# Altium project HIVE_SIGHT.PrjPcb (part 3 of 4)

## Sheet HIVE_SIGHT_DECAWAVE_B.SchDoc
size Tabloid; SheetNumber: 4; SheetTotal: 6; Sheet_Name: DECAWAVE; Size: 11x17
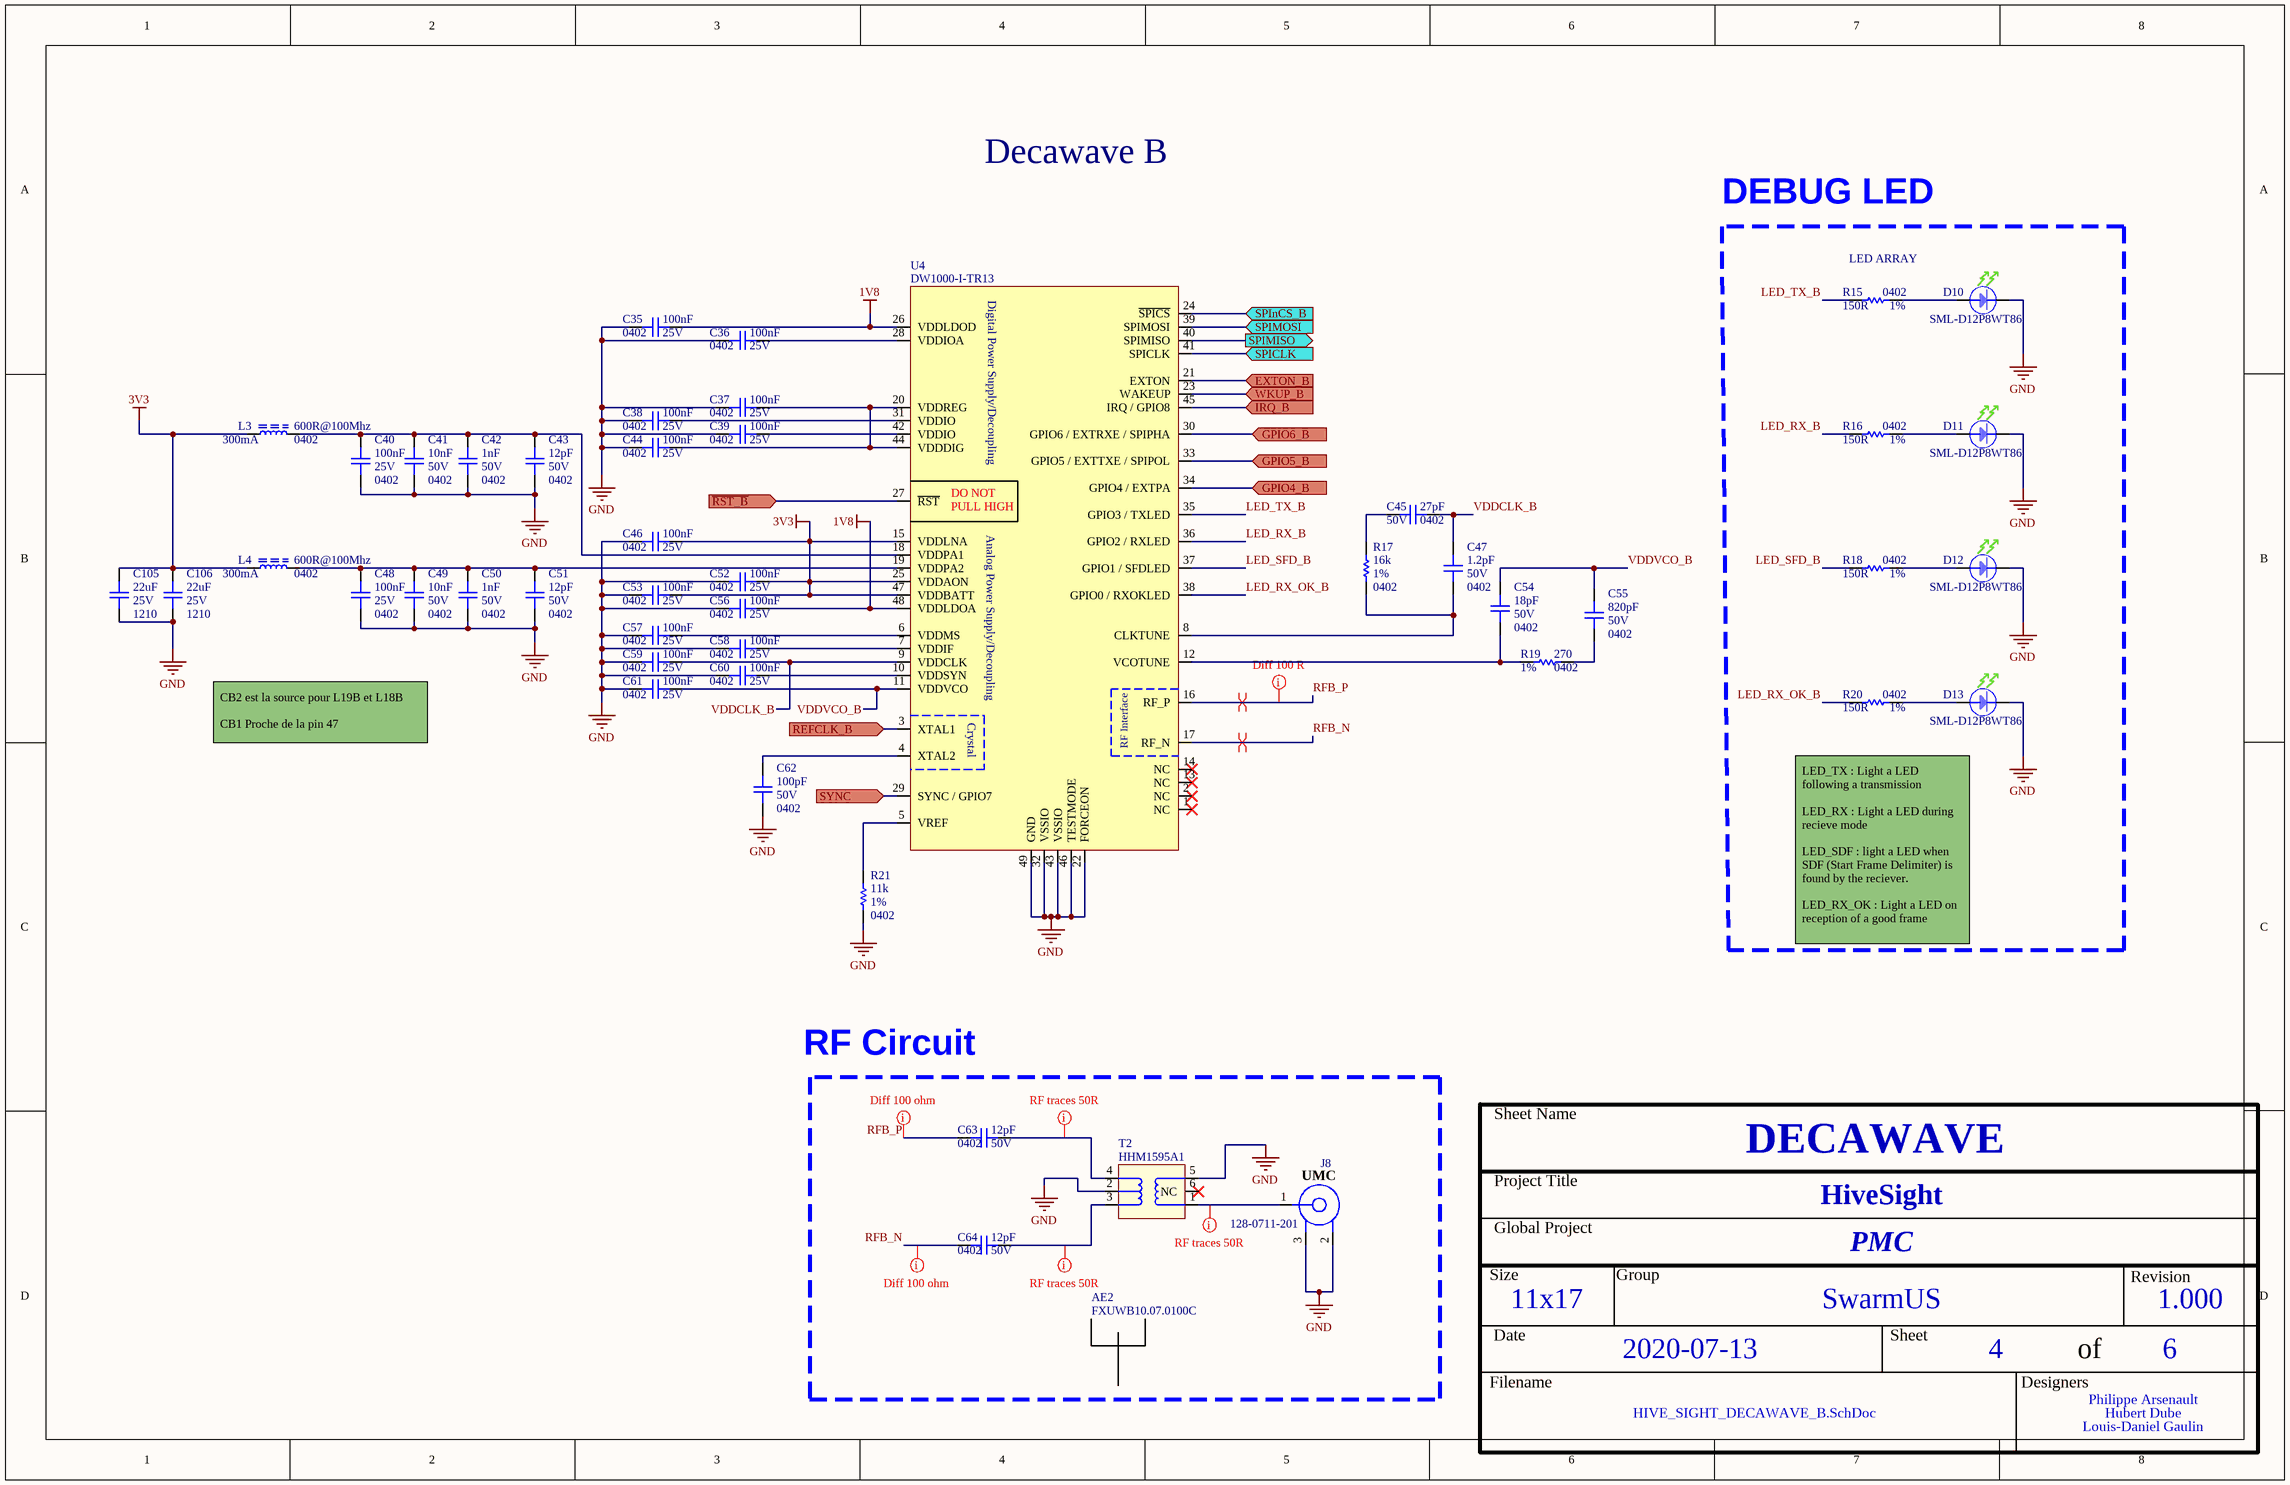
[diagram p6: HIVE_SIGHT_DECAWAVE_B.SchDoc]

### Parts
AE2  FXUWB10.07.0100C  (mechanical)
C35  value 100nF  Package: 0402  Voltage Rating: 25V  [CAP_CER_0402]  (hidden comment: CGA2B3X7R1E104K050BB)
C36  value 100nF  Package: 0402  Voltage Rating: 25V  [CAP_CER_0402]  (hidden comment: CGA2B3X7R1E104K050BB)
C37  value 100nF  Package: 0402  Voltage Rating: 25V  [CAP_CER_0402]  (hidden comment: CGA2B3X7R1E104K050BB)
C38  value 100nF  Package: 0402  Voltage Rating: 25V  [CAP_CER_0402]  (hidden comment: CGA2B3X7R1E104K050BB)
C39  value 100nF  Package: 0402  Voltage Rating: 25V  [CAP_CER_0402]  (hidden comment: CGA2B3X7R1E104K050BB)
C40  value 100nF  Package: 0402  Voltage Rating: 25V  [CAP_CER_0402]  (hidden comment: CGA2B3X7R1E104K050BB)
C41  value 10nF  Package: 0402  Voltage Rating: 50V  [CAP_CER_0402]  (hidden comment: CL05B103KB5NFNC)
C42  value 1nF  Package: 0402  Voltage Rating: 50V  [CAP_CER_0402]  (hidden comment: CC0402KRX7R9BB102)
C43  value 12pF  Package: 0402  Voltage Rating: 50V  [CAP_CER_0402]  (hidden comment: CC0402JRNPO9BN120)
C44  value 100nF  Package: 0402  Voltage Rating: 25V  [CAP_CER_0402]  (hidden comment: CGA2B3X7R1E104K050BB)
C45  value 27pF  Package: 0402  Voltage Rating: 50V  [CAP_CER_0402]  (hidden comment: CC0402JRNPO9BN270)
C46  value 100nF  Package: 0402  Voltage Rating: 25V  [CAP_CER_0402]  (hidden comment: CGA2B3X7R1E104K050BB)
C47  value 1.2pF  Package: 0402  Voltage Rating: 50V  [CAP_CER_0402]  (hidden comment: C0402C129C5GACTU)
C48  value 100nF  Package: 0402  Voltage Rating: 25V  [CAP_CER_0402]  (hidden comment: CGA2B3X7R1E104K050BB)
C49  value 10nF  Package: 0402  Voltage Rating: 50V  [CAP_CER_0402]  (hidden comment: CL05B103KB5NFNC)
C50  value 1nF  Package: 0402  Voltage Rating: 50V  [CAP_CER_0402]  (hidden comment: CC0402KRX7R9BB102)
C51  value 12pF  Package: 0402  Voltage Rating: 50V  [CAP_CER_0402]  (hidden comment: CC0402JRNPO9BN120)
C52  value 100nF  Package: 0402  Voltage Rating: 25V  [CAP_CER_0402]  (hidden comment: CGA2B3X7R1E104K050BB)
C53  value 100nF  Package: 0402  Voltage Rating: 25V  [CAP_CER_0402]  (hidden comment: CGA2B3X7R1E104K050BB)
C54  value 18pF  Package: 0402  Voltage Rating: 50V  [CAP_CER_0402]  (hidden comment: GRM1555C1H180GA01D)
C55  value 820pF  Package: 0402  Voltage Rating: 50V  [CAP_CER_0402]  (hidden comment: CC0402KRX7R9BB821)
C56  value 100nF  Package: 0402  Voltage Rating: 25V  [CAP_CER_0402]  (hidden comment: CGA2B3X7R1E104K050BB)
C57  value 100nF  Package: 0402  Voltage Rating: 25V  [CAP_CER_0402]  (hidden comment: CGA2B3X7R1E104K050BB)
C58  value 100nF  Package: 0402  Voltage Rating: 25V  [CAP_CER_0402]  (hidden comment: CGA2B3X7R1E104K050BB)
C59  value 100nF  Package: 0402  Voltage Rating: 25V  [CAP_CER_0402]  (hidden comment: CGA2B3X7R1E104K050BB)
C60  value 100nF  Package: 0402  Voltage Rating: 25V  [CAP_CER_0402]  (hidden comment: CGA2B3X7R1E104K050BB)
C61  value 100nF  Package: 0402  Voltage Rating: 25V  [CAP_CER_0402]  (hidden comment: CGA2B3X7R1E104K050BB)
C62  value 100pF  Package: 0402  Voltage Rating: 50V  [CAP_CER_0402]  (hidden comment: CC0402JRNPO9BN101)
C63  value 12pF  Package: 0402  Voltage Rating: 50V  [CAP_CER_0402]  (hidden comment: CC0402JRNPO9BN120)
C64  value 12pF  Package: 0402  Voltage Rating: 50V  [CAP_CER_0402]  (hidden comment: CC0402JRNPO9BN120)
C105  value 22uF  Package: 1210  Voltage Rating: 25V  [CAP_CER_1210]  (hidden comment: C3225X7R1E226M250AB)
C106  value 22uF  Package: 1210  Voltage Rating: 25V  [CAP_CER_1210]  (hidden comment: C3225X7R1E226M250AB)
D10  SML-D12P8WT86  [LED_SML-D12P8WT86]
D11  SML-D12P8WT86  [LED_SML-D12P8WT86]
D12  SML-D12P8WT86  [LED_SML-D12P8WT86]
D13  SML-D12P8WT86  [LED_SML-D12P8WT86]
J8  128-0711-201  [CON_UMC_128-0711-201]
L3  value 600R@100Mhz  Current Rating: 300mA  Package: 0402  [FER_0603]  (hidden comment: BLM15AG601SN1D)
L4  value 600R@100Mhz  Current Rating: 300mA  Package: 0402  [FER_0603]  (hidden comment: BLM15AG601SN1D)
R15  value 150R  Tolerance: 1%  Package: 0402  [RES_0402]  (hidden comment: RC0402FR-07150RL)
R16  value 150R  Tolerance: 1%  Package: 0402  [RES_0402]  (hidden comment: RC0402FR-07150RL)
R17  value 16k  Tolerance: 1%  Package: 0402  [RES_0402]  (hidden comment: RC0402FR-0716KL)
R18  value 150R  Tolerance: 1%  Package: 0402  [RES_0402]  (hidden comment: RC0402FR-07150RL)
R19  value 270  Tolerance: 1%  Package: 0402  [FER_0402]  (hidden comment: RC0402FR-07270RL)
R20  value 150R  Tolerance: 1%  Package: 0402  [RES_0402]  (hidden comment: RC0402FR-07150RL)
R21  value 11k  Tolerance: 1%  Package: 0402  [RES_0402]  (hidden comment: RC0402FR-0711KL)
T2  HHM1595A1  [XFR_HHM1595A1]
U4  DW1000-I-TR13  [COM_XCV_DW1000-I-TR13]

### Blocks framed on the sheet
DEBUG LED: D10-D13 R15 R16 R18 R20

### Ports
EXTON_B (in), GPIO4_B (in), GPIO5_B (in), GPIO6_B (in), IRQ_B (in), REFCLK_B (in), SPICLK (in), SPIMISO (out), SPIMOSI (in), SPInCS_B (in), SYNC (in), WKUP_B (in), ~{RST_B} (in)

### Nets
1V8: C35.1 C56.1 U4.26(VDDLDOD) U4.48(VDDLDOA)
3V3: C46.1 C52.1 C53.1 C105.2 C106.2 L3.1 L4.1 U4.15(VDDLNA) U4.25(VDDAON) U4.47(VDDBATT)
GND: C35.2 C36.2 C37.2 C38.2 C39.2 C40.1 C41.1 C42.1 C43.1 C44.2 C46.2 C48.1 C49.1 C50.1 C51.1 C52.2 C53.2 C56.2 C57.2 C58.2 C59.2 C60.2 C61.2 C62.1 C105.1 C106.1 D10.K D11.K D12.K D13.K J8.2 J8.3 R21.1 T2.2(GND) T2.5 U4.22(FORCEON) U4.32(VSSIO) U4.43(VSSIO) U4.46(TESTMODE) U4.49(GND)
LED_RX_B: R16.2 U4.36(GPIO2_/_RXLED)
LED_RX_OK_B: R20.2 U4.38(GPIO0_/_RXOKLED)
LED_SFD_B: R18.2 U4.37(GPIO1_/_SFDLED)
LED_TX_B: R15.2 U4.35(GPIO3_/_TXLED)
RFB_N: C64.2 U4.17(RF_N)
RFB_P: C63.2 U4.16(RF_P)
RST_B#: U4.27(~{RST}) ; port ~{RST_B}
VDDCLK_B: C45.1 C47.2 C59.1 U4.9(VDDCLK)
VDDVCO_B: C54.2 C55.2 C61.1 U4.11(VDDVCO)
NetC36_1: C36.1 U4.28(VDDIOA)
NetC37_1: C37.1 C44.1 U4.20(VDDREG) U4.44(VDDDIG)
NetC38_1: C38.1 U4.31(VDDIO)
NetC39_1: C39.1 U4.42(VDDIO)
NetC40_2: C40.2 C41.2 C42.2 C43.2 L3.2 U4.18(VDDPA1)
NetC45_2: C45.2 R17.2
NetC47_1: C47.1 R17.1 U4.8(CLKTUNE)
NetC48_2: C48.2 C49.2 C50.2 C51.2 L4.2 U4.19(VDDPA2)
NetC54_1: C54.1 R19.2 U4.12(VCOTUNE)
NetC55_1: C55.1 R19.1
NetC57_1: C57.1 U4.6(VDDMS)
NetC58_1: C58.1 U4.7(VDDIF)
NetC60_1: C60.1 U4.10(VDDSYN)
NetC62_2: C62.2 U4.4(XTAL2)
NetC63_1: C63.1 T2.4
NetC64_1: C64.1 T2.3
NetC66_1: U4.3(XTAL1) ; port REFCLK_B
NetD10_A: D10.A R15.1
NetD11_A: D11.A R16.1
NetD12_A: D12.A R18.1
NetD13_A: D13.A R20.1
NetJ8_1: J8.1 T2.1
NetR21_2: R21.2 U4.5(VREF)
NetU3_29: U4.29(SYNC_/_GPIO7) ; port SYNC
NetU3_39: U4.39(SPIMOSI) ; port SPIMOSI
NetU3_40: U4.40(SPIMISO) ; port SPIMISO
NetU3_41: U4.41(SPICLK) ; port SPICLK
NetU4_21: U4.21(EXTON) ; port EXTON_B
NetU4_23: U4.23(WAKEUP) ; port WKUP_B
NetU4_24: U4.24(~{SPICS}) ; port SPInCS_B
NetU4_30: U4.30(GPIO6_/_EXTRXE_/_SPIPHA) ; port GPIO6_B
NetU4_33: U4.33(GPIO5_/_EXTTXE_/_SPIPOL) ; port GPIO5_B
NetU4_34: U4.34(GPIO4_/_EXTPA) ; port GPIO4_B
NetU4_45: U4.45(IRQ_/_GPIO8) ; port IRQ_B

Not connected (* = marked no-connect by the designer): T2 6(NC)*; U4 1(NC)* 2(NC)* 13(NC)* 14(NC)*

### Layout directives
mark named RF traces 50R: NetC63_1, NetC64_1, NetJ8_1
mark named Diff 100 ohm: RFB_N, RFB_P
differential pair: RFB_N, RFB_P
mark named Diff 100 R: RFB_P

### Notes on the sheet
- Decawave B
- (near R15) LED ARRAY
- CB2 est la source pour L19B et L18B
  CB1 Proche de la pin 47
- LED_TX : Light a LED following a transmission
  LED_RX : Light a LED during recieve mode
  LED_SDF : light a LED when SDF (Start Frame Delimiter) is found by the reciever.
  LED_RX_OK : Light a LED on reception of a good frame
- RF Circuit
- Sheet Name
- Project Title
- Global Project
- Size
- Group
- Revision
- Date
- Sheet
- of
- Filename
- Designers
- (in symbol COM_XCV_DW1000-I-TR13) Digital Power Supply/Decoupling; DO NOT; PULL HIGH; Analog Power Supply/Decoupling; Crystal; RF Interface
- (in symbol CON_UMC_128-0711-201) UMC

### Library data of the parts
AE2 = ANT_FXUWB10.07.0100C: External antenna - UWB - UMCC plug; Value: 3.0-10.3GHz; GRAMS Lib Spec: 2.8; HelpURL: http://cdn.taoglas.com/datasheets/FXUWB10.07.0100C.pdf; CreatedBy/Date: Philippe Arsenault; Temperature: -40°C to 85°C; Package: 50 ohm; Assembly Type: UMCC plug; Part Number #1: FXUWB10.07.0100C; Supplier 1: Digi-Key; Supplier Part Number 1: 931-1523-ND
C35-C40 C44 C46 C48 C52 C53 C56-C61 = CAP_CER_CGA2B3X7R1E104K050BB: CAP - CER 0.1µF 10% 25V X7R - 0402; Manufacturer #1: TDK Corporation; GRAMS Lib Spec: 2.8; Magnetic Material: Unknown; Polarized: NO; Assembly Type: SMD; CreatedBy/Date: Nicolas Roy 2018-11-07; Current Rating: *; HelpURL: https://product.tdk.com/info/en/catalog/datasheets/mlcc_automotive_general_en.pdf; Manufacturer #2: *; Note: *; Part Number #1: CGA2B3X7R1E104K050BB; Part Number #2: *; Power Max: *; Temperature: -55°C ~ 125°C; Tolerance: 10%; VerifiedBy: Nicolas V. (2019-01-22); Supplier 1: Digi-Key; Supplier Part Number 1: 445-6902-1-ND; Cryo: UNKNOWN
C41 C49 = CAP_CER_CL05B103KB5NFNC: CAP - CER 10nF ±10% 50V X7R - 0402; Manufacturer #1: Samsung Electro-Mechanics; GRAMS Lib Spec: 2.8; Magnetic Material: Unknown; Polarized: No; Assembly Type: SMD; CreatedBy/Date: Keven Deslandes - 2018/11/20; Current Rating: *; HelpURL: http://www.samsungsem.com/kr/support/product-search/mlcc/CL05B103KB5NFNC.jsp; Manufacturer #2: *; Note: *; Part Number #1: CL05B103KB5NFNC; Part Number #2: *; Power Max: *; Temperature: -55°C ~ 125°C; Tolerance: 10%; VerifiedBy: Nicolas Roy - 2018/12/11; Supplier 1: Digi-Key; Supplier Part Number 1: 1276-1499-1-ND; Cryo: UNKNOWN
C42 C50 = CAP_CER_CC0402KRX7R9BB102: CAP - CER 1nF 10% 50V X7R - 0402; Manufacturer #1: Yageo; GRAMS Lib Spec: 2.8; Magnetic Material: UNKNOWN; Polarized: NO; Assembly Type: SMD; CreatedBy/Date: Jonathan Bouchard 2019-04-06; Current Rating: *; HelpURL: http://www.yageo.com/documents/recent/UPY-GPHC_X7R_6.3V-to-50V_18.pdf; Manufacturer #2: *; Note: *; Part Number #1: CC0402KRX7R9BB102; Part Number #2: *; Power Max: *; Temperature: -55°C ~ 125°C; Tolerance: 10%; VerifiedBy: Nicolas V. (2019-04-30); Supplier 1: Digi-Key; Supplier Part Number 1: 311-1036-1-ND; Cryo: UNKNOWN
C43 C51 C63 C64 = CAP_CER_CC0402JRNPO9BN120: CAP - CER 12pF 50V ±5% C0G, NP0 - 0402; Manufacturer #1: Yageo; GRAMS Lib Spec: 2.8; Magnetic Material: Unknown; Polarized: NO; Assembly Type: SMD; CreatedBy/Date: Philippe Arsenault/ 2020-07-24; Current Rating: *; HelpURL: https://www.yageo.com/upload/media/product/productsearch/datasheet/mlcc/UPY-GP_NP0_16V-to-50V_18.pdf; Manufacturer #2: *; Note: *; Part Number #1: CC0402JRNPO9BN120; Part Number #2: *; Power Max: *; Temperature: -55°C ~ 125°C; Tolerance: ±5%; VerifiedBy: Louis-Daniel Gaulin / 2020-07-29; Cryo: UNKNOWN; Supplier 1: Digi-Key; Supplier Part Number 1: 311-1016-1-ND
C45 = CAP_CER_CC0402JRNPO9BN270: CAP - CER 27pF 50V ±5% C0G, NP0 - 0402; Manufacturer #1: Yageo; GRAMS Lib Spec: 2.8; Magnetic Material: Unknown; Polarized: NO; Assembly Type: SMD; CreatedBy/Date: Philippe Arsenault/ 2020-07-24; Current Rating: *; HelpURL: https://www.yageo.com/upload/media/product/productsearch/datasheet/mlcc/UPY-GP_NP0_16V-to-50V_18.pdf; Manufacturer #2: *; Note: *; Part Number #1: CC0402JRNPO9BN270; Part Number #2: *; Power Max: *; Temperature: -55°C ~ 125°C; Tolerance: ±5%; VerifiedBy: Louis-Daniel Gaulin / 2020-07-29; Cryo: UNKNOWN; Supplier 1: Digi-Key; Supplier Part Number 1: 311-1019-1-ND
C47 = CAP_CER_C0402C129C5GACTU: CAP - CER 1.2pF 50V ±0.25pF C0G, NP0 - 0402; Manufacturer #1: KEMET; GRAMS Lib Spec: 2.8; Magnetic Material: Unknown; Polarized: NO; Assembly Type: SMD; CreatedBy/Date: Philippe Arsenault/ 2020-07-24; Current Rating: *; HelpURL: https://content.kemet.com/datasheets/KEM_C1003_C0G_SMD.pdf; Manufacturer #2: *; Note: *; Part Number #1: C0402C129C5GACTU; Part Number #2: *; Power Max: *; Temperature: -55°C ~ 125°C; Tolerance: ±0.25pF; VerifiedBy: Louis-Daniel Gaulin / 2020-07-29; Cryo: UNKNOWN; Supplier 1: Digi-Key; Supplier Part Number 1: 399-1001-1-ND
C54 = CAP_CER_GRM1555C1H180GA01D: CAP - CER 18pF 50V C0G, NPO - 0402; Manufacturer #1: Murata Electronics North America; Tolerance: 2%; GRAMS Lib Spec: 2.8; Note: Not for new Design; Magnetic Material: UNKNOWN; Polarized: NO; Current Rating: *; Power Max: *; HelpURL: https://psearch.en.murata.com/capacitor/product/GRM1555C1H180GA01%23.html; CreatedBy/Date: Tommy Rossignol / 2018-11-20; VerifiedBy: Caroline Paulin - 13 fév 2019; Temperature: -55°C ~ 125°C; Manufacturer #2: *; Assembly Type: SMD; Part Number #2: *; Part Number #1: GRM1555C1H180GA01D; Supplier 1: Digi-Key; Supplier Part Number 1: 490-6204-1-ND; Cryo: UNKNOWN
C55 = CAP_CER_CC0402KRX7R9BB821: CAP - CER 820pF 50V ±10% X7R - 0402; Manufacturer #1: Yageo; GRAMS Lib Spec: 2.8; Magnetic Material: Unknown; Polarized: NO; Assembly Type: SMD; CreatedBy/Date: Philippe Arsenault/ 2020-07-24; Current Rating: *; HelpURL: https://www.yageo.com/upload/media/product/productsearch/datasheet/mlcc/UPY-GPHC_X7R_6.3V-to-50V_18.pdf; Manufacturer #2: *; Note: *; Part Number #1: CC0402KRX7R9BB821; Part Number #2: *; Power Max: *; Temperature: -55°C ~ 125°C; Tolerance: ±10%; VerifiedBy: Louis-Daniel Gaulin / 2020-07-29; Cryo: UNKNOWN; Supplier 1: Digi-Key; Supplier Part Number 1: 311-1727-1-ND
C62 = CAP_CER_CC0402JRNPO9BN101: CAP - CER 100pF 50V ±5% C0G,CP0 - 0402; Manufacturer #1: Yageo; GRAMS Lib Spec: 2.8; Magnetic Material: Unknown; Polarized: NO; Assembly Type: SMD; CreatedBy/Date: Philippe Arsenault/ 2020-07-24; Current Rating: *; HelpURL: https://www.yageo.com/upload/media/product/productsearch/datasheet/mlcc/UPY-GPHC_X7R_6.3V-to-50V_18.pdf; Manufacturer #2: *; Note: *; Part Number #1: CC0402JRNPO9BN101; Part Number #2: *; Power Max: *; Temperature: -55°C ~ 125°C; Tolerance: ±5%; VerifiedBy: Louis-Daniel Gaulin / 2020-07-29; Cryo: UNKNOWN; Supplier 1: Digi-Key; Supplier Part Number 1: 311-1024-1-ND
C105 C106 = CAP_CER_C3225X7R1E226M250AB: CAP - CER 22UF 20% 25V X7R - 1210; Manufacturer #1: TDK Corporation; GRAMS Lib Spec: 2.8; Magnetic Material: Unknown; Polarized: No; Tolerance: 20%; Current Rating: *; Power Max: *; HelpURL: https://product.tdk.com/info/en/documents/chara_sheet/C3225X7R1E226M250AB.pdf; CreatedBy/Date: Nicolas V. (2019-12-11); VerifiedBy: Nicolas V. (2019-12-11); Temperature: -55°C ~ 125°C; Manufacturer #2: *; Note: *; Assembly Type: SMD; Part Number #2: *; Part Number #1: C3225X7R1E226M250AB; Supplier 1: Digi-Key; Supplier Part Number 1: 445-181602-1-ND; Cryo: UNKNOWN
D10-D13 = LED_SML-D12P8WT86: LED - GREEN DIFFUSED 0603 SMD - 0603; Manufacturer #1: Rohm Semiconductor; Current Rating: 1-20mA; Note: Operate at 2mA; Value: 560 nm (green); Voltage rating: 2.2V (Forward), 5V (max Reverse); Polarized: Yes; Magnetic Material: Unknown; GRAMS Lib Spec: 2.8; Manufacturer #2: *; Power Max: *; Part Number #1: SML-D12P8WT86; Part Number #2: *; HelpURL: https://d1d2qsbl8m0m72.cloudfront.net/en/products/databook/datasheet/opto/led/chip_mono/sml-d12x8_d13x8-e.pdf; Supplier 1: Digi-Key; Supplier Part Number 1: 511-1579-2-ND; Assembly Type: SMD; Temperature: -40 ~ 85 °C; Package: 0603; CreatedBy/Date: Keven Deslandes - 2018/11/21; Tolerance: *; VerifiedBy: Caroline Paulin - 13 février 2019; Cryo: UNKNOWN
J8 = CON_UMC_128-0711-201: CON - UMC JACK STR 50 OHM - SMD; Manufacturer #1: Cinch Connectivity Solutions Johnson; Note: Straight; Value: 50 Ohm, 6 GHz; Voltage rating: 200V; Polarized: No; GRAMS Lib Spec: 2.8; Cryo: UNKNOWN; Current Rating: *; Manufacturer #2: *; Power Max: *; Part Number #1: 128-0711-201; Part Number #2: *; HelpURL: https://belfuse.com/resources/cinch-brochures/CCS%20Johnson%20UMC%20Ultra%20Miniature%20Connectors.pdf; Supplier 1: Digi-Key; Supplier Part Number 1: J983CT-ND; Assembly Type: SMD; Magnetic Material: *; Temperature: -40°C ~ 90°C; Package: SMD; CreatedBy/Date: Keven Desandes - 2018/09/27; Tolerance: *; VerifiedBy: Caroline Paulin - 23 janv 2019
L3 L4 = FER_BLM15AG601SN1D: FER - FERRITE BEAD 600 OHM@100MHz - 0402; Manufacturer #1: Murata; GRAMS Lib Spec: 2.8; Magnetic Material: YES; Polarized: NO; Cryo: UNKNOWN; Tolerance: *; Voltage Rating: *; Power Max: *; HelpURL: https://www.murata.com/en-us/products/productdata/8796740059166/ENFA0018.pdf; CreatedBy/Date: Philippe Arsenault/2020-07-24; Temperature: -55°C ~ 125°C; Manufacturer #2: *; Note: *; Assembly Type: SMD; Part Number #2: *; Part Number #1: BLM15AG601SN1D; Supplier 1: Digi-Key; Supplier Part Number 1: 490-1006-1-ND
R15 R16 R18 R20 = RES_RC0402FR-07150RL: RES - 150R 1% 1/16W - 0402; Manufacturer #1: Yageo; GRAMS Lib Spec: 2.8; Magnetic Material: Unknown; Polarized: No; Voltage Rating: 50V; Assembly Type: SMD; CreatedBy/Date: Jonathan Bouchard 2019-03-25; Current Rating: *; HelpURL: http://www.yageo.com/documents/recent/PYu-RC_Group_51_RoHS_L_10.pdf; Manufacturer #2: *; Part Number #1: RC0402FR-07150RL; Part Number #2: *; Power Max: 1/16W; Temperature: -55°C ~ 155°C; VerifiedBy: Nicolas V. (2019-05-02); Supplier 1: Digi-Key; Supplier Part Number 1: 311-150LRCT-ND; Cryo: UNKNOWN
R17 = RES_RC0402FR-0716KL: RES - 16k OHM 1% 1/16W - 0402; Manufacturer #1: Yageo; GRAMS Lib Spec: 2.8; Magnetic Material: Unknown; Polarized: NO; Voltage Rating: 50V; Assembly Type: SMD; CreatedBy/Date: Nicolas Roy/18 oct. 2018; Current Rating: *; HelpURL: http://www.yageo.com/documents/recent/PYu-RC_Group_51_RoHS_L_9.pdf; Manufacturer #2: *; Part Number #1: RC0402FR-0716KL; Part Number #2: *; Power Max: 1/16W; Temperature: -55°C ~ 155°C; VerifiedBy: Caroline Paulin - 18/12/2018; Supplier 1: Digi-Key; Supplier Part Number 1: 311-16.0KLRCT-ND; Cryo: UNKNOWN
R19 = RES_RC0402FR-07270RL: RES - 270R 1% 1/16W - 0402; Manufacturer #1: Yageo; GRAMS Lib Spec: 2.8c; Magnetic Material: Unknown; Polarized: No; Voltage Rating: 50V; Assembly Type: SMD; CreatedBy/Date: Philippe Arsenault 2020-07-24; Current Rating: *; HelpURL: https://www.yageo.com/upload/media/product/productsearch/datasheet/rchip/PYu-RC_Group_51_RoHS_L_10.pdf; Manufacturer #2: *; Note: *; Part Number #1: RC0402FR-07270RL; Part Number #2: *; Power Max: 1/16W; Temperature: -55°C ~ 155°C; VerifiedBy: Louis-Daniel Gaulin / 03-10-2020; Supplier 1: Digi-Key; Supplier Part Number 1: 311-270LRCT-ND
R21 = RES_RC0402FR-0711KL: RES - 11K 1% 1/16W - 0402; Manufacturer #1: Yageo; GRAMS Lib Spec: 2.8; Magnetic Material: Unknown; Polarized: No; Voltage Rating: 50V; Assembly Type: SMD; CreatedBy/Date: Keven Deslandes 2018-10-15; Current Rating: *; HelpURL: http://www.yageo.com/documents/recent/PYu-RC_Group_51_RoHS_L_9.pdf; Manufacturer #2: *; Part Number #1: RC0402FR-0711KL; Part Number #2: *; Power Max: 1/16W; Temperature: -55°C ~ 155°C; VerifiedBy: Carolilne Paulin - 18/12/2018; Supplier 1: Digi-Key; Supplier Part Number 1: 311-11.0KLRCT-ND; Cryo: UNKNOWN
T2 = XFR_HHM1595A1: XFR - Imp Unbalaced/Balanced 50/100 3-8GHz  -SMD; Manufacturer #1: TDK; Value: 3GHz  ~ 8GHz; GRAMS Lib Spec: 2.8; Magnetic Material: Unknown; Polarized: Yes; Tolerance: *; Voltage Rating: *; Current Rating: *; Power Max: *; HelpURL: https://product.tdk.com/info/en/documents/data_sheet/rf_balun_hhm1595a1_en.pdf; CreatedBy/Date: Philippe Arsenault/2020-21-07; VerifiedBy: Louis-Daniel Gaulin / 03-10-2020; Temperature: -40°C ~ 85°C; Package: 0805; Manufacturer #2: *; Note: *; Assembly Type: MT; Part Number #2: *; Part Number #1: HHM1595A1; Supplier 1: Digi-Key; Supplier Part Number 1: 445-3387-1-ND
U4 = COM_XCV_DW1000-I-TR13: COM - IC RF TxRx 802.15.4 IR-UWB DECAWAVE - 48-VFQFN EP; Voltage Rating: 2.8 - 3.6 V; Current Rating: Rx 64mA/Tx 31mA; GRAMS Lib Spec: 2.8; Magnetic Material: Unknown; Polarized: Yes; Cryo: No; Value: *; Tolerance: *; Power Max: *; HelpURL: https://www.decawave.com/sites/default/files/resources/DW1000-Datasheet-V2.12.pdf; CreatedBy/Date: Philippe Arsenault/13-07-2020; Temperature: -40°C ~ 85°C; Package: QFN 48; Manufacturer #1: Decawave; Manufacturer #2: Qorvo; Note: *; Assembly Type: SMT; Part Number #2: *; Part Number #1: DW1000-I-TR13; Supplier 1: Digi-Key; Supplier Part Number 1: 1479-1001-1-ND

## Sheet HIVE_SIGHT_MISC.SchDoc
size Tabloid; SheetNumber: 4; SheetTotal: 6; Sheet_Name: DECAWAVE; Size: 11x17
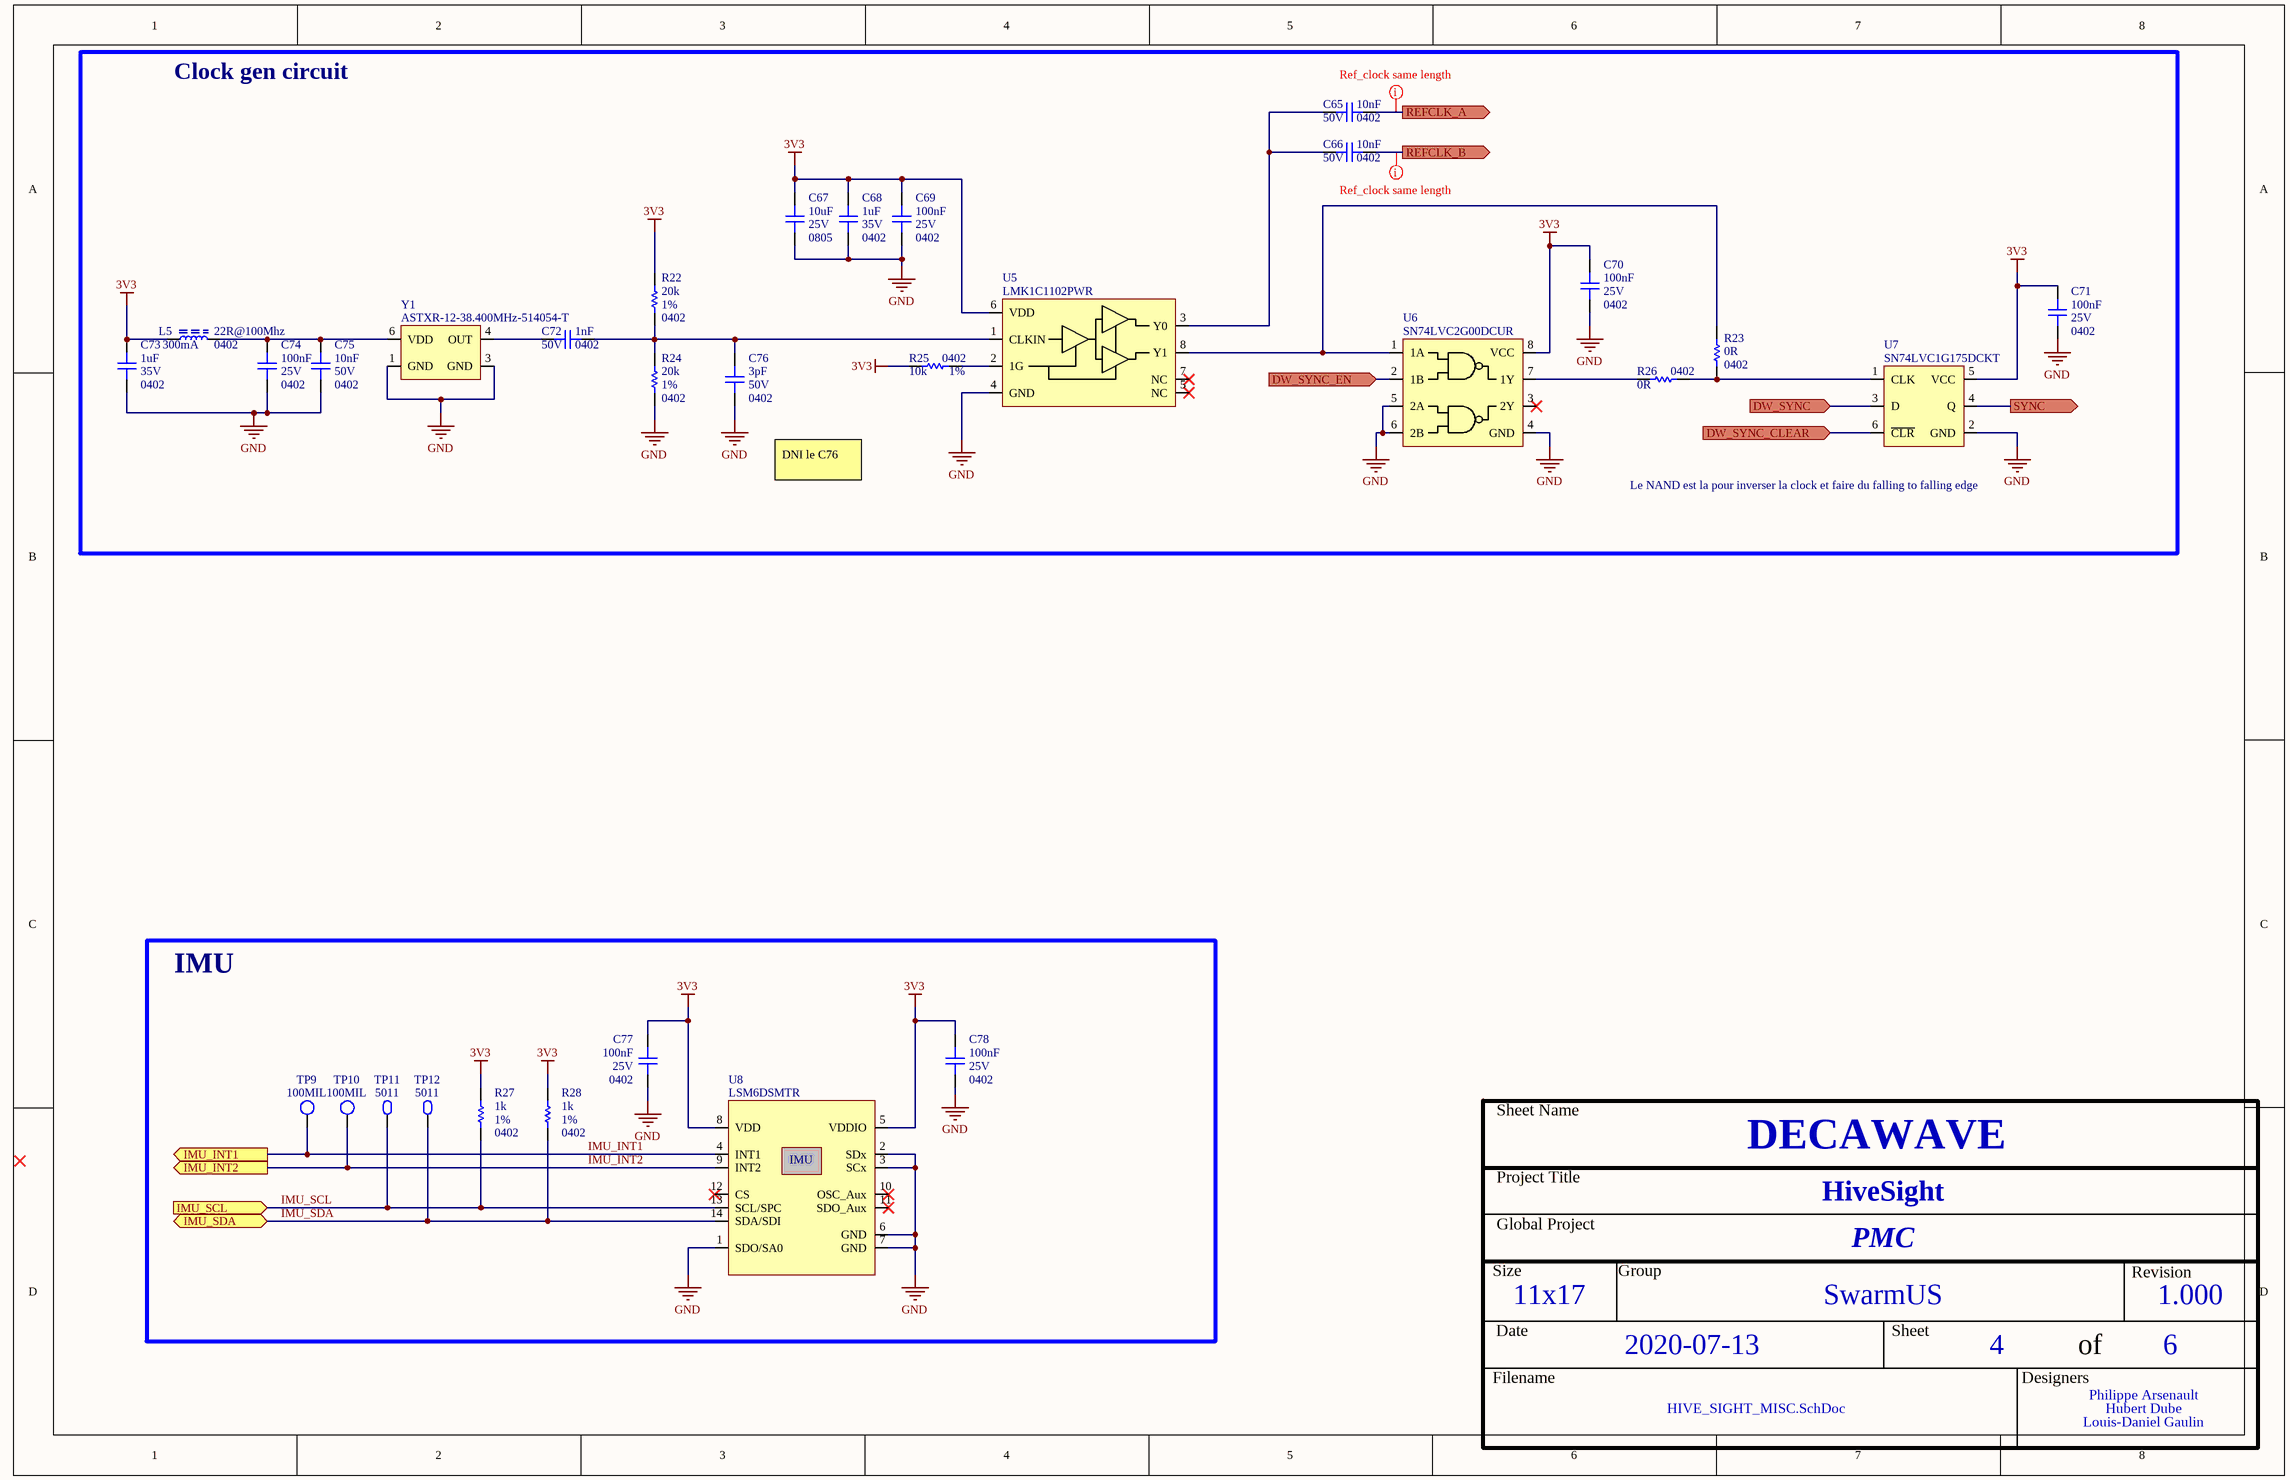
[diagram p7: HIVE_SIGHT_MISC.SchDoc]

### Parts
C65  value 10nF  Package: 0402  Voltage Rating: 50V  [CAP_CER_0402]  (hidden comment: C0402C103M5RACTU)
C66  value 10nF  Package: 0402  Voltage Rating: 50V  [CAP_CER_0402]  (hidden comment: C0402C103M5RACTU)
C67  value 10uF  Package: 0805  Voltage Rating: 25V  [CAP_CER_0805]  (hidden comment: GRM21BC71E106KE11L)
C68  value 1uF  Package: 0402  Voltage Rating: 35V  [CAP_CER_0402]  (hidden comment: CL05A105KL5NRNC)
C69  value 100nF  Package: 0402  Voltage Rating: 25V  [CAP_CER_0402]  (hidden comment: CL05A104KA5NNNC)
C70  value 100nF  Package: 0402  Voltage Rating: 25V  [CAP_CER_0402]  (hidden comment: CL05A104KA5NNNC)
C71  value 100nF  Package: 0402  Voltage Rating: 25V  [CAP_CER_0402]  (hidden comment: CL05A104KA5NNNC)
C72  value 1nF  Package: 0402  Voltage Rating: 50V  [CAP_CER_0402]  (hidden comment: CC0402KRX7R9BB102)
C73  value 1uF  Package: 0402  Voltage Rating: 35V  [CAP_CER_0402]  (hidden comment: CL05A105KL5NRNC)
C74  value 100nF  Package: 0402  Voltage Rating: 25V  [CAP_CER_0402]  (hidden comment: CL05A104KA5NNNC)
C75  value 10nF  Package: 0402  Voltage Rating: 50V  [CAP_CER_0402]  (hidden comment: C0402C103M5RACTU)
C76  value 3pF  Package: 0402  Voltage Rating: 50V  [CAP_CER_0402]  (hidden comment: CC0402CRNPO9BN3R0)
C77  value 100nF  Package: 0402  Voltage Rating: 25V  [CAP_CER_0402]  (hidden comment: CGA2B3X7R1E104K050BB)
C78  value 100nF  Package: 0402  Voltage Rating: 25V  [CAP_CER_0402]  (hidden comment: CGA2B3X7R1E104K050BB)
L5  value 22R@100Mhz  Current Rating: 300mA  Package: 0402  [FER_0402]  (hidden comment: BLM15BB220SN1D)
R22  value 20k  Tolerance: 1%  Package: 0402  [RES_0402]  (hidden comment: RC0402FR-0720KL)
R23  value 0R  Package: 0402  [RES_0402]  (hidden comment: RC0402FR-070RL)
R24  value 20k  Tolerance: 1%  Package: 0402  [RES_0402]  (hidden comment: RC0402FR-0720KL)
R25  value 10k  Tolerance: 1%  Package: 0402  [RES_0402]  (hidden comment: RC0402FR-0710KL)
R26  value 0R  Package: 0402  [RES_0402]  (hidden comment: RC0402FR-070RL)
R27  value 1k  Tolerance: 1%  Package: 0402  [RES_0402]  (hidden comment: RC0402FR-071KL)
R28  value 1k  Tolerance: 1%  Package: 0402  [RES_0402]  (hidden comment: RC0402FR-071KL)
TP9  100MIL  [TPO_TH_ROUND_100MIL]  (no BOM)
TP10  100MIL  [TPO_TH_ROUND_100MIL]  (no BOM)
TP11  5011  [TPO_5011]
TP12  5011  [TPO_5011]
U5  LMK1C1102PWR  [COM_BUF_LMK1C1102PWR]
U6  SN74LVC2G00DCUR  [LOG_NAND_SN74LVC2G00DCUR]
U7  SN74LVC1G175DCKT  [LOG_FLIPFLOP_SN74LVC1G175DCKT]
U8  LSM6DSMTR  [SEN_IMU_LSM6DSMTR]
Y1  ASTXR-12-38.400MHz-514054-T  [OSC_ASTXR-12-38.400MHZ-514054-T]

### Blocks framed on the sheet
Clock gen circuit: C65-C76 L5 R22-R26 U5-U7 Y1
IMU: C77 C78 R27 R28 TP9-TP12 U8

### Ports
DW_SYNC (in), DW_SYNC_CLEAR (in), DW_SYNC_EN (in), IMU_INT1 (out), IMU_INT2 (out), IMU_SCL (in), IMU_SDA (bidir), REFCLK_A (out), REFCLK_B (out), SYNC (out)

### Nets
3V3: C67.2 C68.2 C69.2 C70.2 C71.1 C73.2 C77.1 C78.1 L5.1 R22.2 R25.2 R27.1 R28.1 U5.6(VDD) U6.8(VCC) U7.5(VCC) U8.5(VDDIO) U8.8(VDD)
GND: C67.1 C68.1 C69.1 C70.1 C71.2 C73.1 C74.1 C75.1 C76.1 C77.2 C78.2 R24.1 U5.4(GND) U6.4(GND) U6.5(2A) U6.6(2B) U7.2(GND) U8.1(SDO/SA0) U8.2(SDx) U8.3(SCx) U8.6(GND) U8.7(GND) Y1.1(GND) Y1.3(GND)
IMU_INT1: TP9.1 U8.4(INT1) ; port IMU_INT1
IMU_INT2: TP10.1 U8.9(INT2) ; port IMU_INT2
IMU_SCL: R27.2 TP11.1 U8.13(SCL/SPC) ; port IMU_SCL
IMU_SDA: R28.2 TP12.1 U8.14(SDA/SDI) ; port IMU_SDA
NetC65_1: C65.1 ; port REFCLK_A
NetC65_2: C65.2 C66.2 U5.3(Y0)
NetC66_1: C66.1 ; port REFCLK_B
NetC72_1: C72.1 C76.2 R22.1 R24.2 U5.1(CLKIN)
NetC72_2: C72.2 Y1.4(OUT)
NetC74_2: C74.2 C75.2 L5.2 Y1.6(VDD)
NetR23_1: R23.1 R26.1 U7.1(CLK)
NetR23_2: R23.2 U5.8(Y1) U6.1(1A)
NetR25_1: R25.1 U5.2(1G)
NetR26_2: R26.2 U6.7(1Y)
NetU3_29: U7.4(Q) ; port SYNC
NetU6_2: U6.2(1B) ; port DW_SYNC_EN
NetU7_3: U7.3(D) ; port DW_SYNC
NetU7_6: U7.6(~{CLR}) ; port DW_SYNC_CLEAR

Not connected (* = marked no-connect by the designer): U5 5(NC)* 7(NC)*; U6 3(2Y)*; U8 10(OSC_Aux)* 11(SDO_Aux)* 12(CS)*

### Layout directives
mark named Ref_clock same length: NetC65_1, NetC66_1

### Notes on the sheet
- DNI le C76
- (near U7) Le NAND est la pour inverser la clock et faire du falling to falling edge
- Sheet Name
- Project Title
- Global Project
- Size
- Group
- Revision
- Date
- Sheet
- of
- Filename
- Designers
- (in symbol SEN_IMU_LSM6DSMTR) IMU

### Library data of the parts
C65 C66 C75 = CAP_CER_C0402C103M5RACTU: CAP - CER 10nF 50V X7R 20% - 0402; Manufacturer #1: KEMET; GRAMS Lib Spec: 2.8; Magnetic Material: Unknown; Polarized: No; Tolerance: 20%; Current Rating: *; Power Max: *; HelpURL: https://api.kemet.com/component-edge/download/datasheet/C0402C103M5RACTU.pdf; CreatedBy/Date: Keven Deslandes - 2018/11/09; VerifiedBy: Nicolas Roy - 2018/12/11; Temperature: -55°C ~ 125°C; Manufacturer #2: *; Note: *; Assembly Type: SMD; Part Number #2: *; Part Number #1: C0402C103M5RACTU; Supplier 1: Digi-Key; Supplier Part Number 1: 399-7760-1-ND; Cryo: UNKNOWN
C67 = CAP_CER_GRM21BC71E106KE11L: CAP - CER 10UF 10% 25V X7S - 0805; Manufacturer #1: Murata; GRAMS Lib Spec: 2.8; Magnetic Material: Unknown; Polarized: NO; Assembly Type: SMD; CreatedBy/Date: Caroline Paulin / 8 août 2018; Current Rating: *; HelpURL: https://search.murata.co.jp/Ceramy/image/img/A01X/G101/ENG/GRM21BC71E106KE11-01.pdf; Manufacturer #2: *; Note: *; Part Number #1: GRM21BC71E106KE11L; Part Number #2: *; Power Max: *; Temperature: -55°C ~ 125°C; Tolerance: 10%; VerifiedBy: Nicolas V. (2019-01-22); Supplier 1: Digi-Key; Supplier Part Number 1: 490-10496-1-ND; Cryo: UNKNOWN
C68 C73 = CAP_CER_CL05A105KL5NRNC: CAP - CER 1uF 10% 35V X5R - 0402; Manufacturer #1: Samsung Electro-Mechanics; GRAMS Lib Spec: 2.8; Magnetic Material: Unknown; Polarized: NO; Assembly Type: SMD; CreatedBy/Date: Nicolas Roy 2018-10-03; Current Rating: *; HelpURL: http://www.samsungsem.com/kr/support/product-search/mlcc/__icsFiles/afieldfile/2018/06/19/CL05A105KL5NRNC.pdf; Manufacturer #2: *; Part Number #1: CL05A105KL5NRNC; Part Number #2: *; Power Max: *; Temperature: -55°C ~ 85°C; Tolerance: 10%; VerifiedBy: Caroline Paulin - 18 janv 2019; Supplier 1: Digi-Key; Supplier Part Number 1: 1276-6796-1-ND; Cryo: UNKNOWN
C69-C71 C74 = CAP_CER_CL05A104KA5NNNC: CAP - CER 0.1uF 10% 25V X5R - 0402; Manufacturer #1: Samsung Electro-Mechanics; GRAMS Lib Spec: 2.8; Magnetic Material: Unknown; Polarized: NO; Assembly Type: SMD; CreatedBy/Date: Keven Deslandes - 2018/09/26; Current Rating: *; HelpURL: http://www.samsungsem.com/kr/support/product-search/mlcc/CL05A104KA5NNNC.jsp; Manufacturer #2: *; Note: *; Part Number #1: CL05A104KA5NNNC; Part Number #2: *; Power Max: *; Temperature: -55°C ~ 85°C; Tolerance: 10%; VerifiedBy: Nicolas Roy - 2018/12/11; Supplier 1: Digi-Key; Supplier Part Number 1: 1276-1043-1-ND; Cryo: UNKNOWN
C72 = CAP_CER_CC0402KRX7R9BB102: as C42 on sheet HIVE_SIGHT_DECAWAVE_B; Assembly Type: SMD; CreatedBy/Date: Jonathan Bouchard 2019-04-06; Current Rating: *; HelpURL: http://www.yageo.com/documents/recent/UPY-GPHC_X7R_6.3V-to-50V_18.pdf; Manufacturer #2: *; Note: *; Part Number #1: CC0402KRX7R9BB102; Part Number #2: *; Power Max: *; Temperature: -55°C ~ 125°C; Tolerance: 10%; VerifiedBy: Nicolas V. (2019-04-30); Supplier 1: Digi-Key; Supplier Part Number 1: 311-1036-1-ND; Cryo: UNKNOWN
C76 = CAP_CER_CC0402CRNPO9BN3R0: CAP - CER 3pF 50V ±0.25pF C0G, NP0 - 0402; Manufacturer #1: Yageo; GRAMS Lib Spec: 2.8; Magnetic Material: Unknown; Polarized: NO; Assembly Type: SMD; CreatedBy/Date: Philippe Arsenault/ 2020-07-24; Current Rating: *; HelpURL: https://www.yageo.com/upload/media/product/productsearch/datasheet/mlcc/UPY-GP_NP0_16V-to-50V_18.pdf; Manufacturer #2: *; Note: *; Part Number #1: CC0402CRNPO9BN3R0; Part Number #2: *; Power Max: *; Temperature: -55°C ~ 125°C; Tolerance: ±0.25pF; VerifiedBy: Louis-Daniel Gaulin / 2020-07-29; Cryo: UNKNOWN; Supplier 1: Digi-Key; Supplier Part Number 1: 311-1007-1-ND
C77 C78 = CAP_CER_CGA2B3X7R1E104K050BB: as C35-C40 on sheet HIVE_SIGHT_DECAWAVE_B; Assembly Type: SMD; CreatedBy/Date: Nicolas Roy 2018-11-07; Current Rating: *; HelpURL: https://product.tdk.com/info/en/catalog/datasheets/mlcc_automotive_general_en.pdf; Manufacturer #2: *; Note: *; Part Number #1: CGA2B3X7R1E104K050BB; Part Number #2: *; Power Max: *; Temperature: -55°C ~ 125°C; Tolerance: 10%; VerifiedBy: Nicolas V. (2019-01-22); Supplier 1: Digi-Key; Supplier Part Number 1: 445-6902-1-ND; Cryo: UNKNOWN
L5 = FER_BLM15BB220SN1D: FER - FERRITE BEAD 22 OHM - 0402; Manufacturer #1: Murata; GRAMS Lib Spec: 2.8; Magnetic Material: YES; Polarized: NO; Cryo: UNKNOWN; Tolerance: *; Voltage Rating: *; Power Max: *; HelpURL: https://www.murata.com/en-us/products/productdata/8796740059166/ENFA0018.pdf; CreatedBy/Date: Philippe Arsenault/2020-11-03; Temperature: -55°C ~ 125°C; Manufacturer #2: *; Note: *; Assembly Type: SMD; Part Number #2: *; Part Number #1: BLM15BB220SN1D; Supplier 1: Digi-Key; Supplier Part Number 1: 490-5187-1-ND
R22 R24 = RES_RC0402FR-0720KL: RES - 20K 1% 1/16W  - 0402; Manufacturer #1: Yageo; GRAMS Lib Spec: 2.8; Magnetic Material: Unknown; Polarized: No; Voltage Rating: 50V; Assembly Type: SMD; CreatedBy/Date: Keven Deslandes 2018-10-18; Current Rating: *; HelpURL: http://www.yageo.com/documents/recent/PYu-RC_Group_51_RoHS_L_10.pdf; Manufacturer #2: *; Note: *; Part Number #1: RC0402FR-0720KL; Part Number #2: *; Power Max: 1/16W; Temperature: -55°C ~ 155°C; VerifiedBy: Caroline Paulin - 7 janv 2019; Supplier 1: Digi-Key; Supplier Part Number 1: 311-20.0KLRCT-ND; Cryo: UNKNOWN
R23 R26 = RES_RC0402FR-070RL: RES - 0R 1/16W 1A  - 0402; Manufacturer #1: Yageo; GRAMS Lib Spec: 2.8; Magnetic Material: Unknown; Polarized: No; Voltage Rating: 50V; Assembly Type: SMD; CreatedBy/Date: Keven Deslandes 2018-09-12; Current Rating: 1A; HelpURL: http://www.yageo.com/documents/recent/PYu-RC_Group_51_RoHS_L_10.pdf; Manufacturer #2: *; Note: *; Part Number #1: RC0402FR-070RL; Part Number #2: *; Power Max: 1/16W; Temperature: -55°C ~ 155°C; VerifiedBy: Caroline Paulin - 27 fév 2019; Supplier 1: Digi-Key; Supplier Part Number 1: 311-0.0LRCT-ND; Cryo: UNKNOWN
R25 = RES_RC0402FR-0710KL: RES - 10K OHMS 1% 1/16W - 0402; Manufacturer #1: Yageo; GRAMS Lib Spec: 2.8; Magnetic Material: UNKNOWN; Polarized: NO; Voltage Rating: 50V; Assembly Type: SMD; CreatedBy/Date: Nicolas V. (2018-11-20); Current Rating: *; HelpURL: http://www.yageo.com/documents/recent/PYu-RC_Group_51_RoHS_L_9.pdf; Manufacturer #2: *; Note: *; Part Number #1: RC0402FR-0710KL; Part Number #2: *; Power Max: 1/16W; Temperature: -55°C ~ 155°C; VerifiedBy: Nicolas V. (2018-11-20); Supplier 1: Digi-Key; Supplier Part Number 1: 311-10.0KLRCT-ND; Cryo: UNKNOWN
R27 R28 = RES_RC0402FR-071KL: RES - 1K OHM 1% 1/16W - 0402; Manufacturer #1: Yageo; GRAMS Lib Spec: 2.8; Magnetic Material: YES; Polarized: NO; Voltage Rating: 50V; Cryo: UNKNOWN; Assembly Type: SMD; CreatedBy/Date: Jonathan Bouchard 2018-07-05; Current Rating: *; HelpURL: http://www.yageo.com/documents/recent/PYu-RC_Group_51_RoHS_L_9.pdf; Manufacturer #2: *; Note: *; Part Number #1: RC0402FR-071KL; Part Number #2: *; Power Max: 1/16W; Temperature: -55°C ~ 155°C; VerifiedBy: Arnaud Samson 16-07-18; Supplier 1: Digi-Key; Supplier Part Number 1: 311-1.00KLRCT-ND
TP9 TP10 = TPO_TH_ROUND_100MIL: TPO - TEST POINT ROUND TH  - 100MIL; Magnetic Material: NO; GRAMS Lib Spec: 2.8c; Cryo: UNKNOWN; Current Rating: *; Manufacturer #1: *; Manufacturer #2: *; Note: *; Power Max: *; Value: *; Part Number #1: *; Part Number #2: *; HelpURL: *; Polarized: *; Supplier 1: *; Assembly Type: NONE; Supplier Part Number 1: *; Package: 100 MIL round; CreatedBy/Date: Louis-Daniel Gaulin/ 14/01/2020; Temperature: *; Tolerance: *; VerifiedBy: C.Paulin - 21/01/2020; Voltage Rating: *
TP11 TP12 = TPO_5011: TPO - TEST POINT - TH; Manufacturer #1: Keystone Electronics; Polarized: No; Magnetic Material: UNKNOWN; GRAMS Lib Spec: 2.8; Current Rating: *; Manufacturer #2: *; Note: *; Power Max: *; Value: *; Part Number #1: 5011; Part Number #2: *; HelpURL: https://www.keyelco.com/userAssets/file/M65p56.pdf; Assembly Type: TH; Package: *; CreatedBy/Date: Louis-Daniel Gauli / 02-11-2020; Temperature: *; Tolerance: *; VerifiedBy: Philippe Arsenault/2020-11-06; Voltage Rating: *; Cryo: UNKNOWN; Supplier 1: Digi-Key
U5 = COM_BUF_LMK1C1102PWR: COM - BUF - Clock buffer 3V3, 2V5, 1V8 2 Channel - TSSOP 8; Manufacturer #1: Texas Instruments; Voltage Rating: 1.71V ~ 1.89V, 2.375V ~ 2.625V, 3.135V ~ 3.465V; Current Rating: Input +-20mA ; Output +- 50mA; Power Max: 132mW; GRAMS Lib Spec: 2.8; Magnetic Material: Unknown; Polarized: Yes; Cryo: No; Value: *; Tolerance: *; HelpURL: https://www.ti.com/lit/ds/symlink/lmk1c1102.pdf?ts=1595262014854&ref_url=https%253A%252F%252Fwww.ti.com%252Fproduct%252FLMK1C1102%253Futm_source%253Dgoogle%2526utm_medium%253Dcpc%2526utm_campaign%253Dasc-null-null-GPN_EN-cpc-pf-google-wwe%2526utm_content%253DLMK1C1102%2526ds_k%253DLMK1C1102%2526DCM%253Dyes%2526gclid%253DCjwKCAjwgdX4BRB_EiwAg8O8HUIvo-ksMfq8YInqTklLXWuMoCGXxsnhq04Fqr4kdDFQPSc0fYG9iRoCPvAQAvD_BwE%2526gclsrc%253Daw.ds; CreatedBy/Date: Philippe Arsenault/20-07-2020; VerifiedBy: Louis-Daniel Gaulin / 23-07-2020; Temperature: –40°C to 125°C; Package: TSSOP 8 pin; Note: *; Assembly Type: SMT; Part Number #2: *; Part Number #1: LMK1C1102PWR
U6 = LOG_NAND_SN74LVC2G00DCUR: LOG_NAND - GATE NAND 2CH 2-INP - 8-VSSOP; Manufacturer #1: Texas Instruments; Voltage Rating: 1.65V ~ 5.5V; Current Rating: +-100mA; GRAMS Lib Spec: 2.8; Magnetic Material: Unknown; Polarized: Yes; Cryo: No; Value: *; Tolerance: *; Power Max: *; HelpURL: https://www.ti.com/lit/ds/symlink/sn74lvc2g00.pdf?HQS=TI-null-null-alldatasheets-df-pf-SEP-wwe; CreatedBy/Date: Philippe Arsenault/21-07-2020; VerifiedBy: Louis-Daniel Gaulin / 23-07-2020; Temperature: -40°C ~ 125°C; Package: 8-VSSOP; Manufacturer #2: *; Note: *; Assembly Type: SMD; Part Number #2: *; Part Number #1: SN74LVC2G00DCUR; Supplier Part Number 1: 296-13258-1-ND; Supplier 1: Digi-key
U7 = LOG_FLIPFLOP_SN74LVC1G175DCKT: LOG_FLIPFLOP - Single D flip-flop with Asynchronous clear - SOT-363; Manufacturer #1: Texas Instruments; Part Number #1: SN74LVC1G175DCKR; Voltage Rating: 1.65V ~ 5.5V; Current Rating: 100mA; GRAMS Lib Spec: 2.8; Magnetic Material: Unknown; Polarized: Yes; Cryo: No; Value: *; Tolerance: *; Power Max: *; HelpURL: https://www.ti.com/lit/ds/symlink/sn74lvc1g175.pdf?ts=1594769483993&ref_url=https%253A%252F%252Fwww.google.com%252F; CreatedBy/Date: Philippe Arsenault/21-07-2020; VerifiedBy: Louis-Daniel Gaulin / 03-10-2020; Temperature: -40°C ~ 125°C; Package: SOT-363; Manufacturer #2: *; Note: *; Assembly Type: SMD; Part Number #2: *; Supplier 1: Digi-Key; Supplier Part Number 1: 296-16998-1-ND
U8 = SEN_IMU_LSM6DSMTR: SEN_IMU -  ACCEL/GYRO 6 Axis I2C/SPI - 14-VFLGA; Manufacturer #1: STMicroelectronics; Voltage Rating: 1.71V ~ 3.6V; Current Rating: 0.65mA; Power Max: 3mW; GRAMS Lib Spec: 2.7c; Magnetic Material: Unknown; Polarized: YES; Value: -; Tolerance: -; HelpURL: https://www.st.com/content/ccc/resource/technical/document/datasheet/76/27/cf/88/c5/03/42/6b/DM00218116.pdf/files/DM00218116.pdf/jcr:content/translations/en.DM00218116.pdf; CreatedBy/Date: Louis-Daniel Gaulin / 06-10-2020; VerifiedBy: Philippe Arsenault/2020-11-06; Temperature: -40°C ~ 85°C (TA); Package: 14-VFLGA; Manufacturer #2: -; Note: -; Assembly Type: SMD; Part Number #2: -; Part Number #1: LSM6DSMTR; Supplier 1: Digi-Key; Supplier Part Number 1: 497-16696-1-ND
Y1 = OSC_ASTXR-12-38.400MHz-514054-T: OSC - XTAL - ASTXR-12-38.400MHz-514054-T - 38.4MHz TXCO - Clipped sine - 3V3 +-0.5ppm UWB application; Manufacturer #1: Abracon LLC; Voltage Rating: 3.3V; Current Rating: 2mA; GRAMS Lib Spec: 2.8; Magnetic Material: Unknown; Polarized: Yes; Cryo: No; Value: 38.4MHz; Tolerance: *; Power Max: *; HelpURL: https://4donline.ihs.com/images/VipMasterIC/IC/ABRC/ABRC-S-A0001399357/ABRC-S-A0001399357-1.pdf?hkey=52A5661711E402568146F3353EA87419; CreatedBy/Date: Philippe Arsenault/18-07-2020; VerifiedBy: Louis-Daniel Gaulin / 03-10-2020; Temperature: -40°C ~ 85°C; Package: 6-SMD; Manufacturer #2: Rakon; Note: *; Assembly Type: SMT; Part Number #2: *; Part Number #1: ASTXR-12-38.400MHz-514054-T; Supplier 1: Digi-Key; Supplier Part Number 1: 535-13192-1-ND

## Sheet HIVE_SIGHT_NUCLEO.SchDoc
size Tabloid; Sheet_Name: Insert name in Document Parameters; Size: 11x17
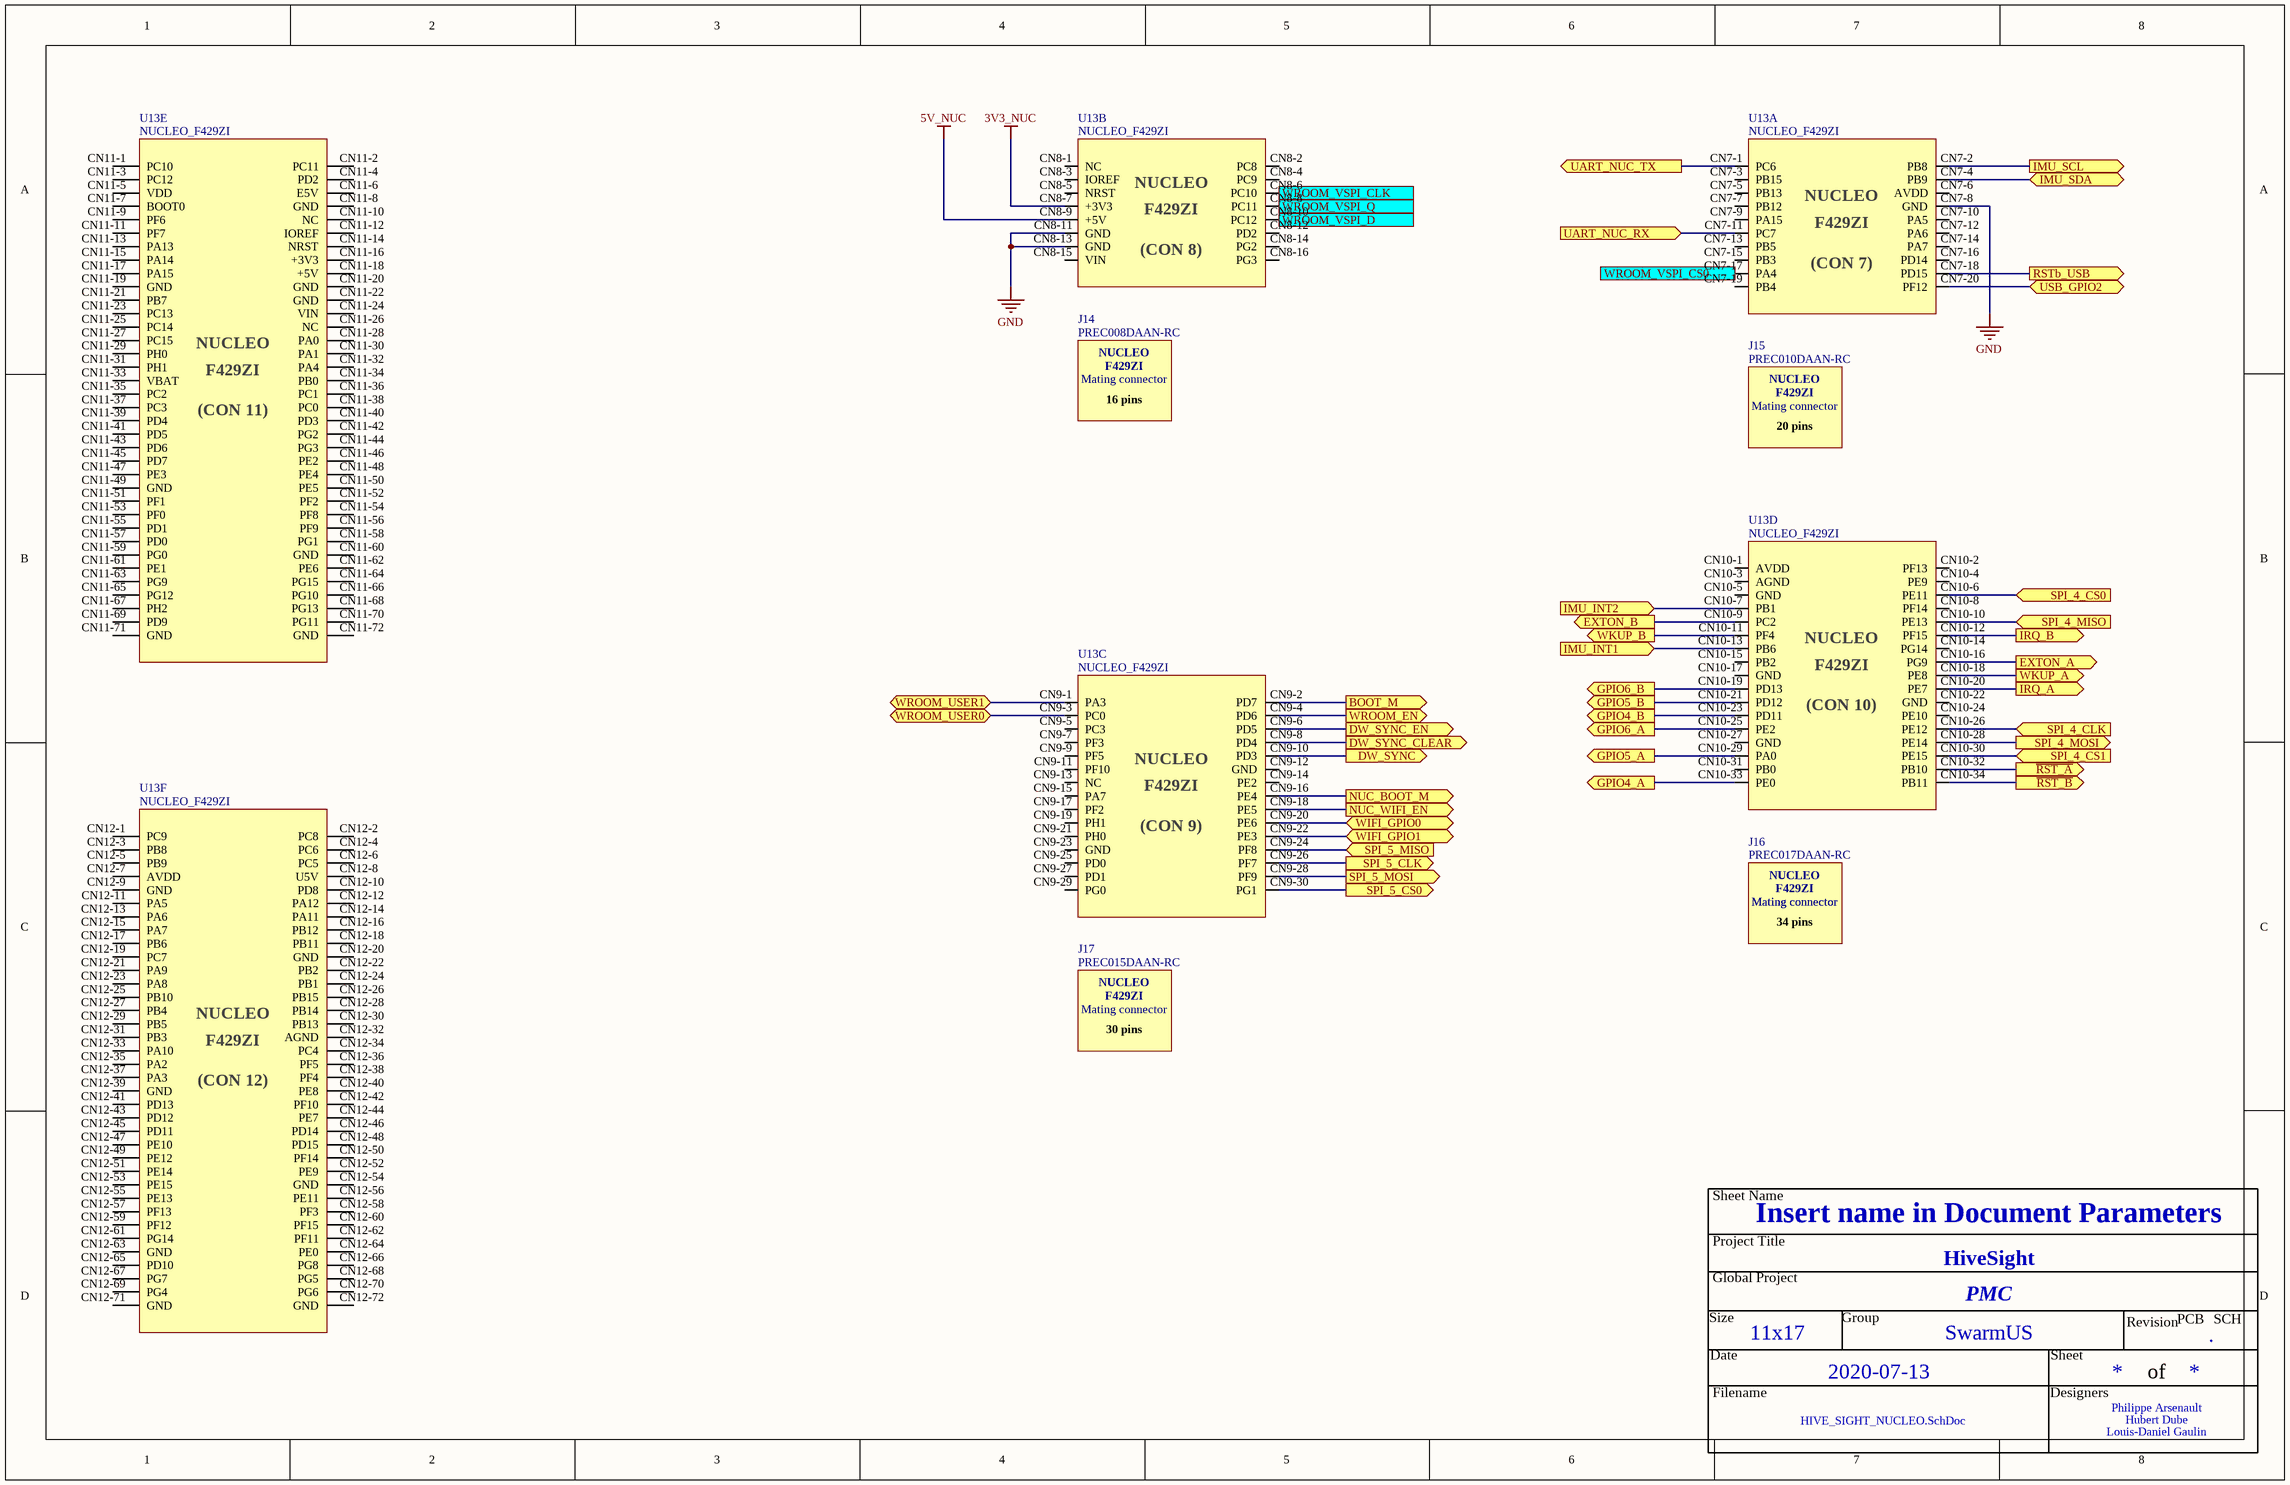
[diagram p8: HIVE_SIGHT_NUCLEO.SchDoc]

### Parts
J14  PREC008DAAN-RC  [CON_HDR_NUCLEO_F429ZI_C008DAAN-RC]
J15  PREC010DAAN-RC  [CON_HDR_NUCLEO_F429ZI_C010DAAN-RC]
J16  PREC017DAAN-RC  [CON_HDR_NUCLEO_F429ZI_C017DAAN-RC]
J17  PREC015DAAN-RC  [CON_HDR_NUCLEO_F429ZI_C015DAAN-RC]
U13  NUCLEO_F429ZI  [MOD_NUCLEO-F429ZI]  (parts A,B,C,D,E,F of 6)

### Ports
BOOT_M (out), DW_SYNC (out), DW_SYNC_CLEAR (out), DW_SYNC_EN (out), EXTON_A (out), EXTON_B (out), GPIO4_A (out), GPIO4_B (out), GPIO5_A (out), GPIO5_B (out), GPIO6_A (out), GPIO6_B (out), IMU_INT1 (in), IMU_INT2 (in), IMU_SCL (out), IMU_SDA (bidir), IRQ_A (out), IRQ_B (out), NUC_BOOT_M (out), NUC_WIFI_EN (out), RSTb_USB (out), SPI_4_CLK (in), SPI_4_CS0 (in), SPI_4_CS1 (in), SPI_4_MISO (in), SPI_4_MOSI (out), SPI_5_CLK (out), SPI_5_CS0 (out), SPI_5_MISO (in), SPI_5_MOSI (out), UART_NUC_RX (in), UART_NUC_TX (out), USB_GPIO2 (bidir), WIFI_GPIO0 (bidir), WIFI_GPIO1 (bidir), WKUP_A (out), WKUP_B (out), WROOM_EN (out), WROOM_USER0 (bidir), WROOM_USER1 (bidir), WROOM_VSPI_CLK (out), WROOM_VSPI_CS0 (out), WROOM_VSPI_D (in), WROOM_VSPI_Q (out), ~{RST_A} (out), ~{RST_B} (out)

### Nets
3V3_NUC: U13.CN8-7(+3V3)
5V_NUC: U13.CN8-9(+5V)
GND: U13.CN7-8(GND) U13.CN8-11(GND) U13.CN8-13(GND)
IMU_INT1: U13.CN10-13(PB6) ; port IMU_INT1
IMU_INT2: U13.CN10-7(PB1) ; port IMU_INT2
IMU_SCL: U13.CN7-2(PB8) ; port IMU_SCL
IMU_SDA: U13.CN7-4(PB9) ; port IMU_SDA
RST_A#: U13.CN10-32(PB10) ; port ~{RST_A}
RST_B#: U13.CN10-34(PB11) ; port ~{RST_B}
VSPI_CLK: U13.CN9-26(PF7) ; port SPI_5_CLK
VSPI_CS0: U13.CN9-30(PG1) ; port SPI_5_CS0
VSPI_D: U13.CN9-24(PF8) ; port SPI_5_MISO
VSPI_Q: U13.CN9-28(PF9) ; port SPI_5_MOSI
NetR38_2: U13.CN9-18(PE5) ; port NUC_WIFI_EN
NetR40_2: U13.CN7-18(PD15) ; port RSTb_USB
NetR46_2: U13.CN9-4(PD6) ; port WROOM_EN
NetU3_21: U13.CN10-16(PG9) ; port EXTON_A
NetU3_23: U13.CN10-18(PE8) ; port WKUP_A
NetU3_24: U13.CN10-6(PE11) ; port SPI_4_CS0
NetU3_30: U13.CN10-25(PE2) ; port GPIO6_A
NetU3_33: U13.CN10-29(PA0) ; port GPIO5_A
NetU3_34: U13.CN10-33(PE0) ; port GPIO4_A
NetU3_39: U13.CN10-28(PE14) ; port SPI_4_MOSI
NetU3_40: U13.CN10-10(PE13) ; port SPI_4_MISO
NetU3_41: U13.CN10-26(PE12) ; port SPI_4_CLK
NetU3_45: U13.CN10-20(PE7) ; port IRQ_A
NetU4_21: U13.CN10-9(PC2) ; port EXTON_B
NetU4_23: U13.CN10-11(PF4) ; port WKUP_B
NetU4_24: U13.CN10-30(PE15) ; port SPI_4_CS1
NetU4_30: U13.CN10-19(PD13) ; port GPIO6_B
NetU4_33: U13.CN10-21(PD12) ; port GPIO5_B
NetU4_34: U13.CN10-23(PD11) ; port GPIO4_B
NetU4_45: U13.CN10-12(PF15) ; port IRQ_B
NetU6_2: U13.CN9-6(PD5) ; port DW_SYNC_EN
NetU7_3: U13.CN9-10(PD3) ; port DW_SYNC
NetU7_6: U13.CN9-8(PD4) ; port DW_SYNC_CLEAR
NetU9_16: U13.CN9-22(PE3) ; port WIFI_GPIO1
NetU9_23: U13.CN9-16(PE4) ; port NUC_BOOT_M
NetU9_27: U13.CN9-20(PE6) ; port WIFI_GPIO0
NetU11_12: U13.CN7-20(PF12) ; port USB_GPIO2
NetU12_3: U13.CN7-11(PC7) ; port UART_NUC_RX
NetU12_7: U13.CN7-1(PC6) ; port UART_NUC_TX
NetU13_CN7-17: U13.CN7-17(PA4) ; port WROOM_VSPI_CS0
NetU13_CN8-6: U13.CN8-6(PC10) ; port WROOM_VSPI_CLK
NetU13_CN8-8: U13.CN8-8(PC11) ; port WROOM_VSPI_Q
NetU13_CN8-10: U13.CN8-10(PC12) ; port WROOM_VSPI_D
NetU13_CN9-1: U13.CN9-1(PA3) ; port WROOM_USER1
NetU13_CN9-2: U13.CN9-2(PD7) ; port BOOT_M
NetU13_CN9-3: U13.CN9-3(PC0) ; port WROOM_USER0

Not connected (* = marked no-connect by the designer): U13 CN7-3(PB15) CN7-5(PB13) CN7-6(AVDD) CN7-7(PB12) CN7-9(PA15) CN7-10(PA5) CN7-12(PA6) CN7-13(PB5) CN7-14(PA7) CN7-15(PB3) CN7-16(PD14) CN7-19(PB4) CN8-1(NC) CN8-2(PC8) CN8-3(IOREF) CN8-4(PC9) CN8-5(NRST) CN8-12(PD2) CN8-14(PG2) CN8-15(VIN) CN8-16(PG3) CN9-5(PC3) CN9-7(PF3) CN9-9(PF5) CN9-11(PF10) CN9-12(GND) CN9-13(NC) CN9-14(PE2) CN9-15(PA7) CN9-17(PF2) CN9-19(PH1) CN9-21(PH0) CN9-23(GND) CN9-25(PD0) CN9-27(PD1) CN9-29(PG0) CN10-1(AVDD) CN10-2(PF13) CN10-3(AGND) CN10-4(PE9) CN10-5(GND) CN10-8(PF14) CN10-14(PG14) CN10-15(PB2) CN10-17(GND) CN10-22(GND) CN10-24(PE10) CN10-27(GND) CN10-31(PB0) CN11-1(PC10) CN11-2(PC11) CN11-3(PC12) CN11-4(PD2) CN11-5(VDD) CN11-6(E5V) CN11-7(BOOT0) CN11-8(GND) CN11-9(PF6) CN11-10(NC) CN11-11(PF7) CN11-12(IOREF) CN11-13(PA13) CN11-14(NRST) CN11-15(PA14) CN11-16(+3V3) CN11-17(PA15) CN11-18(+5V) CN11-19(GND) CN11-20(GND) CN11-21(PB7) CN11-22(GND) CN11-23(PC13) CN11-24(VIN) CN11-25(PC14) CN11-26(NC) CN11-27(PC15) CN11-28(PA0) CN11-29(PH0) CN11-30(PA1) CN11-31(PH1) CN11-32(PA4) CN11-33(VBAT) CN11-34(PB0) CN11-35(PC2) CN11-36(PC1) CN11-37(PC3) CN11-38(PC0) CN11-39(PD4) CN11-40(PD3) CN11-41(PD5) CN11-42(PG2) CN11-43(PD6) CN11-44(PG3) CN11-45(PD7) CN11-46(PE2) CN11-47(PE3) CN11-48(PE4) CN11-49(GND) CN11-50(PE5) CN11-51(PF1) CN11-52(PF2) CN11-53(PF0) CN11-54(PF8) CN11-55(PD1) CN11-56(PF9) CN11-57(PD0) CN11-58(PG1) CN11-59(PG0) CN11-60(GND) CN11-61(PE1) CN11-62(PE6) CN11-63(PG9) CN11-64(PG15) CN11-65(PG12) CN11-66(PG10) CN11-67(PH2) CN11-68(PG13) CN11-69(PD9) CN11-70(PG11) CN11-71(GND) CN11-72(GND) CN12-1(PC9) CN12-2(PC8) CN12-3(PB8) CN12-4(PC6) CN12-5(PB9) CN12-6(PC5) CN12-7(AVDD) CN12-8(U5V) CN12-9(GND) CN12-10(PD8) CN12-11(PA5) CN12-12(PA12) CN12-13(PA6) CN12-14(PA11) CN12-15(PA7) CN12-16(PB12) CN12-17(PB6) CN12-18(PB11) CN12-19(PC7) CN12-20(GND) CN12-21(PA9) CN12-22(PB2) CN12-23(PA8) CN12-24(PB1) CN12-25(PB10) CN12-26(PB15) CN12-27(PB4) CN12-28(PB14) CN12-29(PB5) CN12-30(PB13) CN12-31(PB3) CN12-32(AGND) CN12-33(PA10) CN12-34(PC4) CN12-35(PA2) CN12-36(PF5) CN12-37(PA3) CN12-38(PF4) CN12-39(GND) CN12-40(PE8) CN12-41(PD13) CN12-42(PF10) CN12-43(PD12) CN12-44(PE7) CN12-45(PD11) CN12-46(PD14) CN12-47(PE10) CN12-48(PD15) CN12-49(PE12) CN12-50(PF14) CN12-51(PE14) CN12-52(PE9) CN12-53(PE15) CN12-54(GND) CN12-55(PE13) CN12-56(PE11) CN12-57(PF13) CN12-58(PF3) CN12-59(PF12) CN12-60(PF15) CN12-61(PG14) CN12-62(PF11) CN12-63(GND) CN12-64(PE0) CN12-65(PD10) CN12-66(PG8) CN12-67(PG7) CN12-68(PG5) CN12-69(PG4) CN12-70(PG6) CN12-71(GND) CN12-72(GND)

### Notes on the sheet
- Sheet Name
- Project Title
- Global Project
- Size
- Date
- Group
- Sheet
- Revision
- of
- PCB
- .
- SCH
- Filename
- Designers
- (in symbol CON_HDR_NUCLEO_F429ZI_PREC008DAAN-RC) NUCLEO; F429ZI; Mating connector; 16 pins
- (in symbol CON_HDR_NUCLEO_F429ZI_PREC010DAAN-RC) NUCLEO; F429ZI; Mating connector; 20 pins
- (in symbol CON_HDR_NUCLEO_F429ZI_PREC015DAAN-RC) NUCLEO; F429ZI; Mating connector; 30 pins
- (in symbol CON_HDR_NUCLEO_F429ZI_PREC017DAAN-RC) NUCLEO; F429ZI; Mating connector; 34 pins
- (in symbol MOD_NUCLEO_F429ZI, part A) NUCLEO; F429ZI; (CON 7)
- (in symbol MOD_NUCLEO_F429ZI, part B) NUCLEO; F429ZI; (CON 8)
- (in symbol MOD_NUCLEO_F429ZI, part C) NUCLEO; F429ZI; (CON 9)
- (in symbol MOD_NUCLEO_F429ZI, part D) NUCLEO; F429ZI; (CON 10)
- (in symbol MOD_NUCLEO_F429ZI, part E) NUCLEO; F429ZI; (CON 11)
- (in symbol MOD_NUCLEO_F429ZI, part F) NUCLEO; F429ZI; (CON 12)

### Library data of the parts
J14 = CON_HDR_NUCLEO_F429ZI_PREC008DAAN-RC: CON - Header 16 positions 2x8  0.100" - TH; Manufacturer #1: Sullins Connector Solutions; Current Rating: 3A; GRAMS Lib Spec: 2.8; Magnetic Material: Unknown; Polarized: No; Voltage Rating: 1000VAC; Assembly Type: TH; CreatedBy/Date: Louis-Daniel Gaulin / 21-10-2020; HelpURL: https://drawings-pdf.s3.amazonaws.com/11636.pdf; Manufacturer #2: *; Package: TH; Part Number #2: *; Power Max: *; Supplier 1: Digi-Key; Supplier Part Number 1: S2012EC-08-ND; Temperature: -55°C ~ 105°C; Tolerance: *; Value: *; Part Number #1: PREC008DAAN-RC; Cryo: UNKNOWN
J15 = CON_HDR_NUCLEO_F429ZI_PREC010DAAN-RC: CON - Header 20 positions 2x10  0.100" - TH; Manufacturer #1: Sullins Connector Solutions; Current Rating: 3A; GRAMS Lib Spec: 2.8; Magnetic Material: Unknown; Polarized: No; Voltage Rating: 1000VAC; Assembly Type: TH; CreatedBy/Date: Louis-Daniel Gaulin / 21-10-2020; HelpURL: https://drawings-pdf.s3.amazonaws.com/11636.pdf; Manufacturer #2: *; Package: TH; Part Number #2: *; Power Max: *; Supplier 1: Digi-Key; Supplier Part Number 1: S2012EC-10-ND; Temperature: -55°C ~ 105°C; Tolerance: *; Value: *; Part Number #1: PREC010DAAN-RC; Cryo: UNKNOWN
J16 = CON_HDR_NUCLEO_F429ZI_PREC017DAAN-RC: CON - Header 34 positions 2x17  0.100" - TH; Manufacturer #1: Sullins Connector Solutions; Current Rating: 3A; GRAMS Lib Spec: 2.8; Magnetic Material: Unknown; Polarized: No; Voltage Rating: 1000VAC; Assembly Type: TH; CreatedBy/Date: Louis-Daniel Gaulin / 21-10-2020; HelpURL: https://drawings-pdf.s3.amazonaws.com/11636.pdf; Manufacturer #2: *; Package: TH; Part Number #2: *; Power Max: *; Supplier 1: Digi-Key; Supplier Part Number 1: S2012EC-17-ND; Temperature: -55°C ~ 105°C; Tolerance: *; Value: *; Part Number #1: PREC017DAAN-RC; Cryo: UNKNOWN
J17 = CON_HDR_NUCLEO_F429ZI_PREC015DAAN-RC: CON - Header 30 positions 2x15  0.100" - TH; Manufacturer #1: Sullins Connector Solutions; Current Rating: 3A; GRAMS Lib Spec: 2.8; Magnetic Material: Unknown; Polarized: No; Voltage Rating: 1000VAC; Assembly Type: TH; CreatedBy/Date: Louis-Daniel Gaulin / 21-10-2020; HelpURL: https://drawings-pdf.s3.amazonaws.com/11636.pdf; Manufacturer #2: *; Package: TH; Part Number #2: *; Power Max: *; Supplier 1: Digi-Key; Supplier Part Number 1: S2012EC-15-ND; Temperature: -55°C ~ 105°C; Tolerance: *; Value: *; Part Number #1: PREC015DAAN-RC; Cryo: UNKNOWN
U13 = MOD_NUCLEO_F429ZI: MOD - F429ZI MCU Nucleo development board - MOD; Manufacturer #1: STMicroelectronics; Part Number #1: NUCLEO-F429ZI; Voltage Rating: 3V3 ~ 12V; Current Rating: 800mA; Power Max: 9.6W; GRAMS Lib Spec: 2.8c; Magnetic Material: Unknown; Polarized: Yes; Value: -; Tolerance: -; HelpURL: https://www.st.com/resource/en/user_manual/dm00244518-stm32-nucleo144-boards-mb1137-stmicroelectronics.pdf; CreatedBy/Date: Louis-Daniel Gaulin; Temperature: *; Package: *; Manufacturer #2: *; Note: *; Assembly Type: TH; Part Number #2: -; Supplier 1: Digi-Key; Supplier Part Number 1: 497-16280-ND; Parameter 1: -; Cryo: UNKNOWN